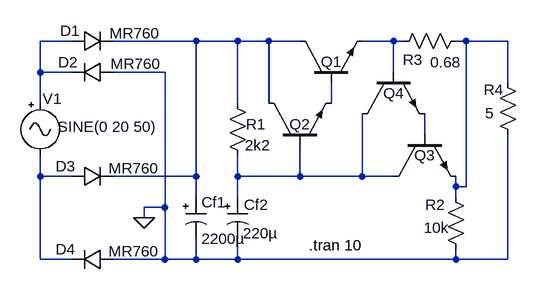
[diagram p0: schematic FteMotorCc.asc]
FteMotorCc.asc, the LTspice schematic file:
Version 4
SHEET 1 880 680
WIRE -400 144 -448 144
WIRE -208 144 -336 144
WIRE -144 144 -208 144
WIRE -96 144 -144 144
WIRE -48 144 -96 144
WIRE 96 144 48 144
WIRE 112 144 96 144
WIRE 208 144 192 144
WIRE 272 144 208 144
WIRE -448 192 -448 144
WIRE -400 192 -448 192
WIRE -256 192 -336 192
WIRE 96 192 96 144
WIRE 272 208 272 144
WIRE -448 240 -448 192
WIRE -144 240 -144 144
WIRE -96 240 -96 144
WIRE 0 240 0 208
WIRE 144 288 144 256
WIRE -448 352 -448 320
WIRE -400 352 -448 352
WIRE -208 352 -208 144
WIRE -208 352 -336 352
WIRE -144 352 -144 320
WIRE -48 352 -48 304
WIRE -48 352 -144 352
WIRE 48 352 48 256
WIRE 48 352 -48 352
WIRE 96 352 48 352
WIRE 192 368 192 352
WIRE 208 368 208 144
WIRE 208 368 192 368
WIRE -208 384 -208 352
WIRE -144 384 -144 352
WIRE 192 384 192 368
WIRE -256 400 -256 192
WIRE -256 400 -288 400
WIRE -288 416 -288 400
WIRE -448 480 -448 352
WIRE -400 480 -448 480
WIRE -256 480 -256 400
WIRE -256 480 -336 480
WIRE -208 480 -208 448
WIRE -208 480 -256 480
WIRE -144 480 -144 448
WIRE -144 480 -208 480
WIRE 192 480 192 464
WIRE 192 480 -144 480
WIRE 272 480 272 288
WIRE 272 480 192 480
FLAG -288 416 0
SYMBOL npn2 -48 208 R270
WINDOW 0 32 32 VRight 0
WINDOW 3 28 85 Invisible 0
SYMATTR InstName Q1
SYMATTR Value BD131
SYMBOL npn2 -96 304 R270
WINDOW 0 32 32 VRight 0
WINDOW 3 28 85 Invisible 0
SYMATTR InstName Q2
SYMATTR Value 2N2222
SYMBOL res -160 224 R0
WINDOW 0 29 48 Left 0
WINDOW 3 27 80 Left 0
SYMATTR InstName R1
SYMATTR Value 2k2
SYMBOL polcap -160 384 R0
WINDOW 0 26 12 Left 0
SYMATTR InstName Cf2
SYMATTR Value 220µ
SYMATTR Description Capacitor
SYMATTR Type cap
SYMATTR SpiceLine V=35 Irms=825m Rser=0.084 MTBF=6000 Lser=0 mfg="United Chemi-Con" pn="LXF35VB221M10X16LL" type="Al electrolytic" ppPkg=1
SYMBOL npn2 96 288 M90
WINDOW 0 32 32 VRight 0
WINDOW 3 28 85 Invisible 0
SYMATTR InstName Q3
SYMATTR Value 2N2222
SYMBOL npn2 48 192 M90
WINDOW 0 32 32 VRight 0
WINDOW 3 28 85 Invisible 0
SYMATTR InstName Q4
SYMATTR Value 2N2222
SYMBOL res 176 368 R0
WINDOW 0 -31 28 Left 0
WINDOW 3 -33 63 Left 0
SYMATTR InstName R2
SYMATTR Value 10k
SYMBOL res 208 128 R90
WINDOW 0 60 82 VBottom 0
WINDOW 3 33 32 VTop 0
SYMATTR InstName R3
SYMATTR Value 0.68
SYMBOL Misc\\signal -448 224 R0
WINDOW 0 4 9 Left 0
WINDOW 3 180 52 Right 0
WINDOW 123 0 0 Left 0
SYMATTR InstName V1
SYMATTR Value SINE(0 20 50)
SYMATTR SpiceLine Rser=10m
SYMBOL diode -400 160 R270
WINDOW 0 16 -2 VTop 0
WINDOW 3 44 98 VBottom 0
SYMATTR InstName D1
SYMATTR Value MR760
SYMBOL diode -336 208 M270
WINDOW 0 16 69 VTop 0
WINDOW 3 45 -35 VBottom 0
SYMATTR InstName D2
SYMATTR Value MR760
SYMBOL diode -400 368 R270
WINDOW 0 16 -9 VTop 0
WINDOW 3 44 96 VBottom 0
SYMATTR InstName D3
SYMATTR Value MR760
SYMBOL diode -336 496 M270
WINDOW 0 16 73 VTop 0
WINDOW 3 44 -32 VBottom 0
SYMATTR InstName D4
SYMATTR Value MR760
SYMBOL polcap -224 384 R0
WINDOW 3 24 64 Left 0
SYMATTR InstName Cf1
SYMATTR Value 2200µ
SYMATTR Description Capacitor
SYMATTR Type cap
SYMATTR SpiceLine V=50 Irms=2.56 Rser=0.024 MTBF=5000 Lser=0 mfg="Nichicon" pn="UPL1H222MRH" type="Al electrolytic" ppPkg=1
SYMBOL res 256 192 R0
WINDOW 0 -21 27 Left 0
WINDOW 3 -19 63 Left 0
SYMATTR InstName R4
SYMATTR Value 5
TEXT -34 458 Left 0 !.tran 10

The netlist it stands for:
* FteMotorCc.asc
Q1 N002 N005 N003 0 BD131
Q2 N002 N008 N005 0 2N2222
R1 N002 N008 2k2
Cf2 N008 0 220µ V=35 Irms=825m Rser=0.084 MTBF=6000 Lser=0 mfg="United Chemi-Con" pn="LXF35VB221M10X16LL" type="Al electrolytic" ppPkg=1
Q3 N008 N006 N004 0 2N2222
Q4 N008 N003 N006 0 2N2222
R2 N004 0 10k
R3 N004 N003 0.68
V1 N001 N007 SINE(0 20 50) Rser=10m
D1 N001 N002 MR760
D2 0 N001 MR760
D3 N007 N002 MR760
D4 0 N007 MR760
Cf1 N002 0 2200µ V=50 Irms=2.56 Rser=0.024 MTBF=5000 Lser=0 mfg="Nichicon" pn="UPL1H222MRH" type="Al electrolytic" ppPkg=1
R4 N004 0 5
.model D D
.lib standard.dio
.model NPN NPN
.model PNP PNP
.lib standard.bjt
.tran 10
.backanno
.end